# EAGLE design pic usboard (EAGLE 5.11)
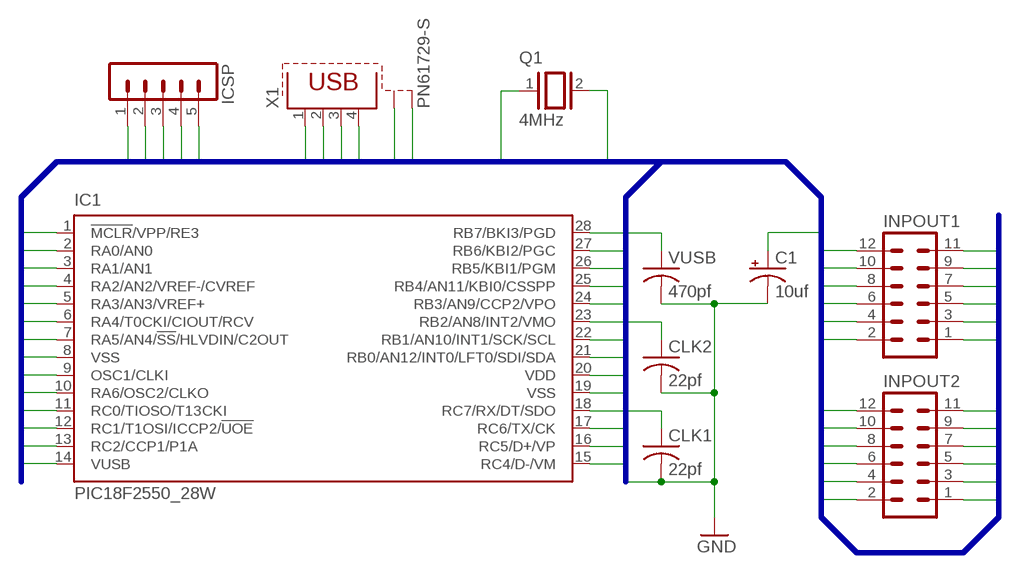
[diagram p0: schematic, sheet 1]

## Parts
C1  10uf  CPOL-USE5-8.5  [E5-8,5]
CLK1  22pf  C-US050-025X075  [C050-025X075]
CLK2  22pf  C-US050-025X075  [C050-025X075]
IC1  PIC18F2550_28W  [SO28W]
ICSP  MA05-1  [MA05-1]
INPOUT1  MA06-2  [MA06-2]
INPOUT2  MA06-2  [MA06-2]
Q1  4MHz  XTAL/S  [QS]
VUSB  470pf  C-US075-042X103  [C075-042X103]
X1  PN61729-S  [PN61729-S]

## Nets
D+: IC1.16(RC5/D+/VP) X1.3
D-: IC1.15(RC4/D-/VM) X1.2
IO1: IC1.1(!MCLR!/VPP/RE3) ICSP.1 INPOUT2.12
IO2: IC1.2(RA0/AN0) INPOUT2.11
IO3: IC1.3(RA1/AN1) INPOUT2.10
IO4: IC1.4(RA2/AN2/VREF-/CVREF) INPOUT2.9
IO5: IC1.5(RA3/AN3/VREF+) INPOUT2.8
IO6: IC1.6(RA4/T0CKI/CIOUT/RCV) INPOUT2.7
IO7: IC1.7(RA5/AN4/!SS!/HLVDIN/C2OUT) INPOUT2.6
IO8: IC1.11(RC0/TIOSO/T13CKI) INPOUT2.5
IO9: IC1.12(RC1/T1OSI/ICCP2/!UOE) INPOUT2.3
IO10: IC1.13(RC2/CCP1/P1A) INPOUT2.4
IO11: IC1.25(RB4/AN11/KBI0/CSSPP) INPOUT1.4
IO12: IC1.24(RB3/AN9/CCP2/VPO) INPOUT1.5
IO13: IC1.23(RB2/AN8/INT2/VMO) INPOUT1.6
IO14: IC1.22(RB1/AN10/INT1/SCK/SCL) INPOUT1.7
IO15: IC1.21(RB0/AN12/INT0/LFT0/SDI/SDA) INPOUT1.8
IO16: IC1.18(RC7/RX/DT/SDO) INPOUT1.9
IO17: IC1.17(RC6/TX/CK) INPOUT1.10
OSC1: CLK1.1 IC1.9(OSC1/CLKI) Q1.1
OSC2: CLK2.1 IC1.10(RA6/OSC2/CLKO) Q1.2
PGC: IC1.27(RB6/KBI2/PGC) ICSP.5 INPOUT1.2
PGD: IC1.28(RB7/BKI3/PGD) ICSP.4 INPOUT1.1
PGM: IC1.26(RB5/KBI1/PGM) INPOUT1.3
VDD: C1.+ IC1.20(VDD) ICSP.2 INPOUT1.12 INPOUT2.2 X1.1
VSS: C1.- CLK1.2 CLK2.2 IC1.8(VSS) IC1.19(VSS) ICSP.3 INPOUT1.11 INPOUT2.1 VUSB.2 X1.4 X1.S1 X1.S2 ; supply symbol labelled GND
VUSB: IC1.14(VUSB) VUSB.1

## Buses
IO[1..17],VSS,VDD,D+,D-,PGD,PGC,PGM,OSC1,OSC2,VUSB

## Library data of the parts
C1 = rcl:CPOL-US: POLARIZED CAPACITOR, American symbol
CLK1 CLK2 VUSB = rcl:C-US: CAPACITOR, American symbol
IC1 = microchip:PIC18F2*_28: USB Microcontrollers with nanoWatt Technology High-Performance, Enhanced Flash, 28/40/44-Pin, Source: http://ww1.microchip.com/downloads/en/devicedoc/39632c.pdf; MF: MICROCHIP; MPN: PIC18F2550-I/SO; OC_FARNELL: 9321268; OC_NEWARK: 73K1297
ICSP = con-lstb:MA05-1: PIN HEADER; OC_FARNELL: unknown; OC_NEWARK: unknown
INPOUT1 INPOUT2 = con-lstb:MA06-2: PIN HEADER; OC_FARNELL: unknown; OC_NEWARK: unknown
Q1 = special:XTAL/S: CRYSTAL
X1 = con-berg:PN61729-S: BERG USB connector; OC_FARNELL: unknown; OC_NEWARK: unknown

## Board
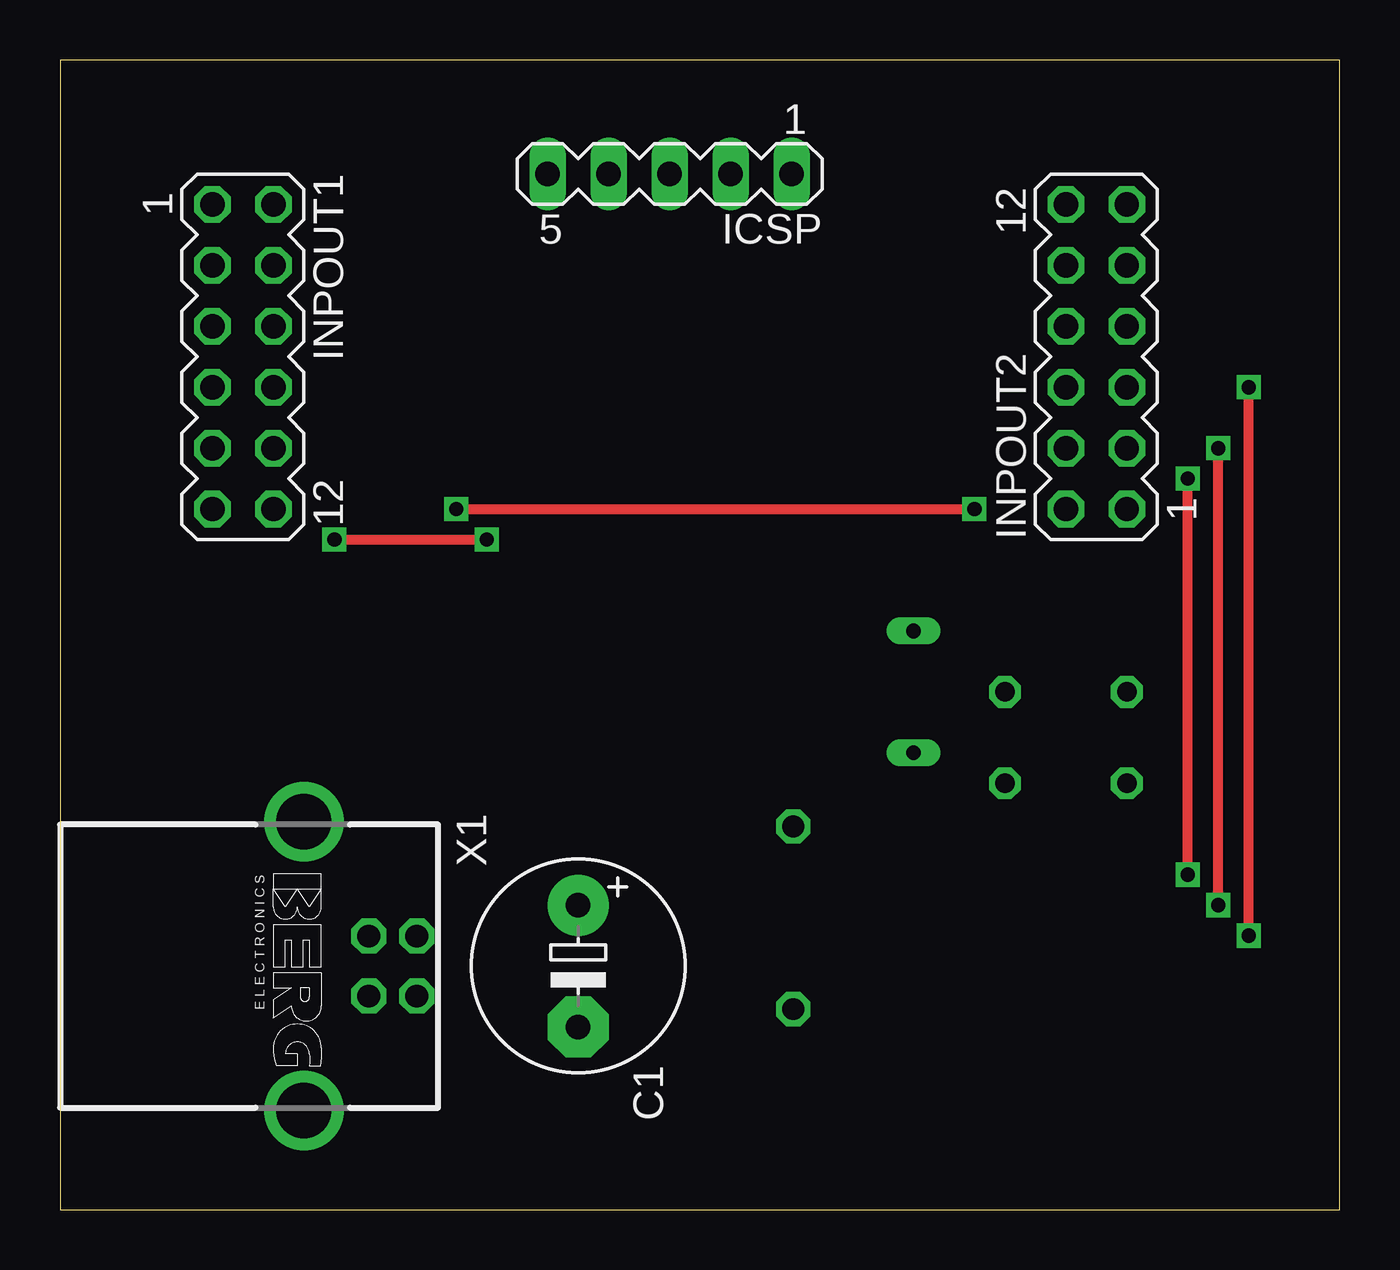
[diagram p1: board, top side]
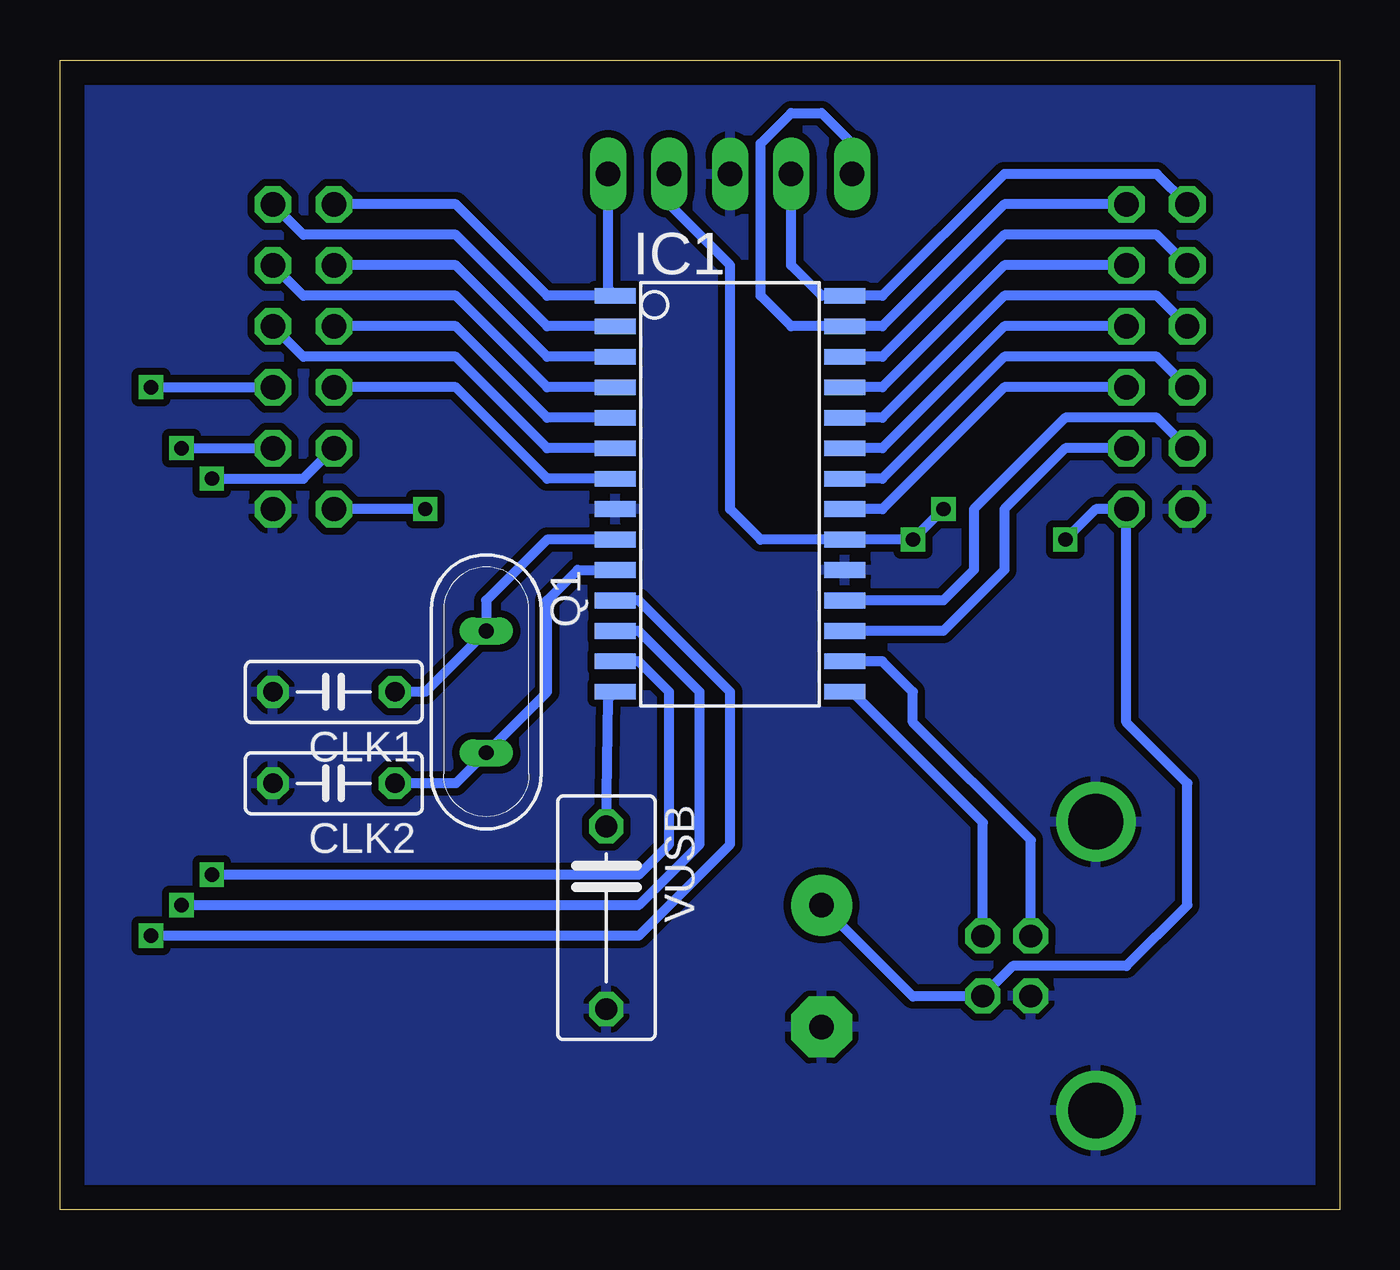
[diagram p2: board, bottom side, seen from below]

Size 53.32 x 47.93 mm. Coordinates in mm from the lower left corner, seen from the top.
Outline: 0,0 53.32,0 53.32,47.93 0,47.93 0,0
Copper layers (1*16): Top 0.035mm / dielectric 1.5mm / Bottom 0.035mm
Design rules "default": minimum track width 10mil, minimum drill 24mil, track to track 8mil, track to pad 8mil, pad to pad 8mil, via to via 8mil, smd to smd 8mil, copper to edge 40mil, drill to drill 8mil, minimum pad ring 10mil, minimum via ring 8mil, stop-mask expansion 4mil, vias tented up to drill 0mil, thermal gap 10mil

### Footprints (pad centres in the part's own frame; a part is rotated, then mirrored left to right if it is on the bottom)
E5-8,5 = drill 1.016 pad 2.54 round: + -2.54,0 | drill 1.016 pad 2.54 octagon: - 2.54,0
C050-025X075 = drill 0.813 octagon: 1 -2.54,0; 2 2.54,0
SO28W = smd 0.65 x 1.7: 1 -7.62,-4.78; 2 -6.35,-4.78; 3 -5.08,-4.78; 4 -3.81,-4.78; 5 -2.54,-4.78; 6 -1.27,-4.78; 7 0,-4.78; 8 1.27,-4.78; 9 2.54,-4.78; 10 3.81,-4.78; 11 5.08,-4.78; 12 6.35,-4.78; 13 7.62,-4.78; 14 8.89,-4.78; 15 8.89,4.78; 16 7.62,4.78; 17 6.35,4.78; 18 5.08,4.78; 19 3.81,4.78; 20 2.54,4.78; 21 1.27,4.78; 22 0,4.78; 23 -1.27,4.78; 24 -2.54,4.78; 25 -3.81,4.78; 26 -5.08,4.78; 27 -6.35,4.78; 28 -7.62,4.78
MA05-1 = drill 1.016 long: 1 -5.08,0; 2 -2.54,0; 3 0,0; 4 2.54,0; 5 5.08,0
MA06-2 = drill 1.016 octagon: 1 -6.35,-1.27; 2 -6.35,1.27; 3 -3.81,-1.27; 4 -3.81,1.27; 5 -1.27,-1.27; 6 -1.27,1.27; 7 1.27,-1.27; 8 1.27,1.27; 9 3.81,-1.27; 10 3.81,1.27; 11 6.35,-1.27; 12 6.35,1.27
QS = drill 0.61 long: 1 -2.54,0; 2 2.54,0
C075-042X103 = drill 0.914 octagon: 1 -3.81,0; 2 3.81,0
PN61729-S = drill 0.95 octagon: 1 1.25,4.71; 2 -1.25,4.71; 3 -1.25,2.71; 4 1.25,2.71 | drill 2.3 pad 2.9 round: S1 -6.02,0; S2 6.02,0

### Placement (x,y rotation side)
C1  21.59,10.16 270 top
CLK1  41.91,21.59 180 bottom
CLK2  41.91,17.78 180 bottom
IC1  25.4,30.48 270 bottom
ICSP  25.4,43.18 180 top
INPOUT1  7.62,35.56 270 top
INPOUT2  43.18,35.56 90 top
Q1  35.56,21.59 270 bottom
VUSB  30.55,12.18 270 bottom
X1  10.16,10.16 270 top

### Tracks (layer width: path | path; a pad name or v marks a point on that pad's centre or on a via)
D+
  Bottom 0.406: X1.3 12.87,15.41 17.78,20.32 17.78,21.59 19.05,22.86 IC1.16
D-
  Bottom 0.406: X1.2 14.87,16.14 20.32,21.59 IC1.15
IO1
  Bottom 0.406: INPOUT2.12 36.83,41.91 33.02,38.1 IC1.1 30.48,38.4 ICSP.1
IO2
  Bottom 0.406: INPOUT2.11 43.18,40.64 36.83,40.64 33.02,36.83 IC1.2
IO3
  Bottom 0.406: INPOUT2.10 36.83,39.37 33.02,35.56 IC1.3
IO4
  Bottom 0.406: INPOUT2.9 43.18,38.1 36.83,38.1 33.02,34.29 IC1.4
IO5
  Bottom 0.406: INPOUT2.8 36.83,36.83 33.02,33.02 IC1.5
IO6
  Bottom 0.406: INPOUT2.7 43.18,35.56 36.83,35.56 33.02,31.75 IC1.6
IO7
  Bottom 0.406: INPOUT2.6 36.83,34.29 33.02,30.48 IC1.7
IO8  (via drill 0.6)
  Top 0.406: v49.53,11.43 v49.53,34.29
  Bottom 0.406: v49.53,34.29 INPOUT2.5 | v49.53,11.43 29.21,11.43 25.4,15.24 25.4,21.59 29.21,25.4 IC1.11
IO9  (via drill 0.6)
  Top 0.406: v48.26,12.7 v48.26,31.75
  Bottom 0.406: v48.26,31.75 INPOUT2.3 | v48.26,12.7 29.21,12.7 26.67,15.24 26.67,21.59 29.21,24.13 IC1.12
IO10  (via drill 0.6)
  Top 0.406: v46.99,13.97 v46.99,30.48
  Bottom 0.406: INPOUT2.4 43.18,30.48 v46.99,30.48 | v46.99,13.97 29.21,13.97 27.94,15.24 27.94,21.59 29.21,22.86 IC1.13
IO11
  Bottom 0.406: INPOUT1.4 13.97,39.37 19.05,34.29 IC1.25
IO12
  Bottom 0.406: INPOUT1.5 7.62,38.1 13.97,38.1 19.05,33.02 IC1.24
IO13
  Bottom 0.406: INPOUT1.6 13.97,36.83 19.05,31.75 IC1.23
IO14
  Bottom 0.406: INPOUT1.7 7.62,35.56 13.97,35.56 19.05,30.48 IC1.22
IO15
  Bottom 0.406: INPOUT1.8 13.97,34.29 19.05,29.21 IC1.21
IO16
  Bottom 0.406: INPOUT1.9 7.62,33.02 11.43,33.02 15.24,29.21 15.24,26.67 16.51,25.4 IC1.18
IO17
  Bottom 0.406: INPOUT1.10 11.43,31.75 13.97,29.21 13.97,26.67 16.51,24.13 IC1.17
OSC1
  Bottom 0.406: IC1.9 33.02,27.94 35.56,25.4 Q1.1 38.1,21.59 CLK1.1
OSC2
  Bottom 0.406: IC1.10 31.75,26.67 33.02,25.4 33.02,21.59 Q1.2 36.83,17.78 CLK2.1
PGC
  Bottom 0.406: INPOUT1.2 13.97,41.91 19.05,36.83 IC1.27 22.86,36.83 24.13,38.1 24.13,44.45 22.86,45.72 21.59,45.72 20.32,44.45 ICSP.5
PGD
  Bottom 0.406: INPOUT1.1 7.62,43.18 13.97,43.18 19.05,38.1 IC1.28 21.59,38.1 22.86,39.37 ICSP.4
PGM
  Bottom 0.406: INPOUT1.3 7.62,40.64 13.97,40.64 19.05,35.56 IC1.26
VDD  (via drill 0.6)
  Top 0.406: v11.43,27.94 v17.78,27.94 | v16.51,29.21 v38.1,29.21
  Bottom 0.406: ICSP.2 27.94,41.91 25.4,39.37 25.4,29.21 24.13,27.94 IC1.20 v17.78,27.94 v16.51,29.21 | C1.+ 17.78,8.89 14.89,8.89 X1.1 13.62,10.16 8.89,10.16 6.35,12.7 6.35,17.78 8.89,20.32 INPOUT1.12 10.16,29.21 v11.43,27.94 | v38.1,29.21 INPOUT2.2
VSS
  pour Bottom (isolate 0.305): 0,0 0,47.9 53.27,47.9 53.27,0
VUSB
  Bottom 0.406: VUSB.1 30.48,21.29 IC1.14